# EasyEDA schematic KegMaster_Satellite_Schematic_EasyEDA_Format.json
TITLE: KegMaster_Satellite; REV: 1.1; Date: 2019-10-18; Sheet: 1/1; Drawn By: John Grenard; Company: John Grenard
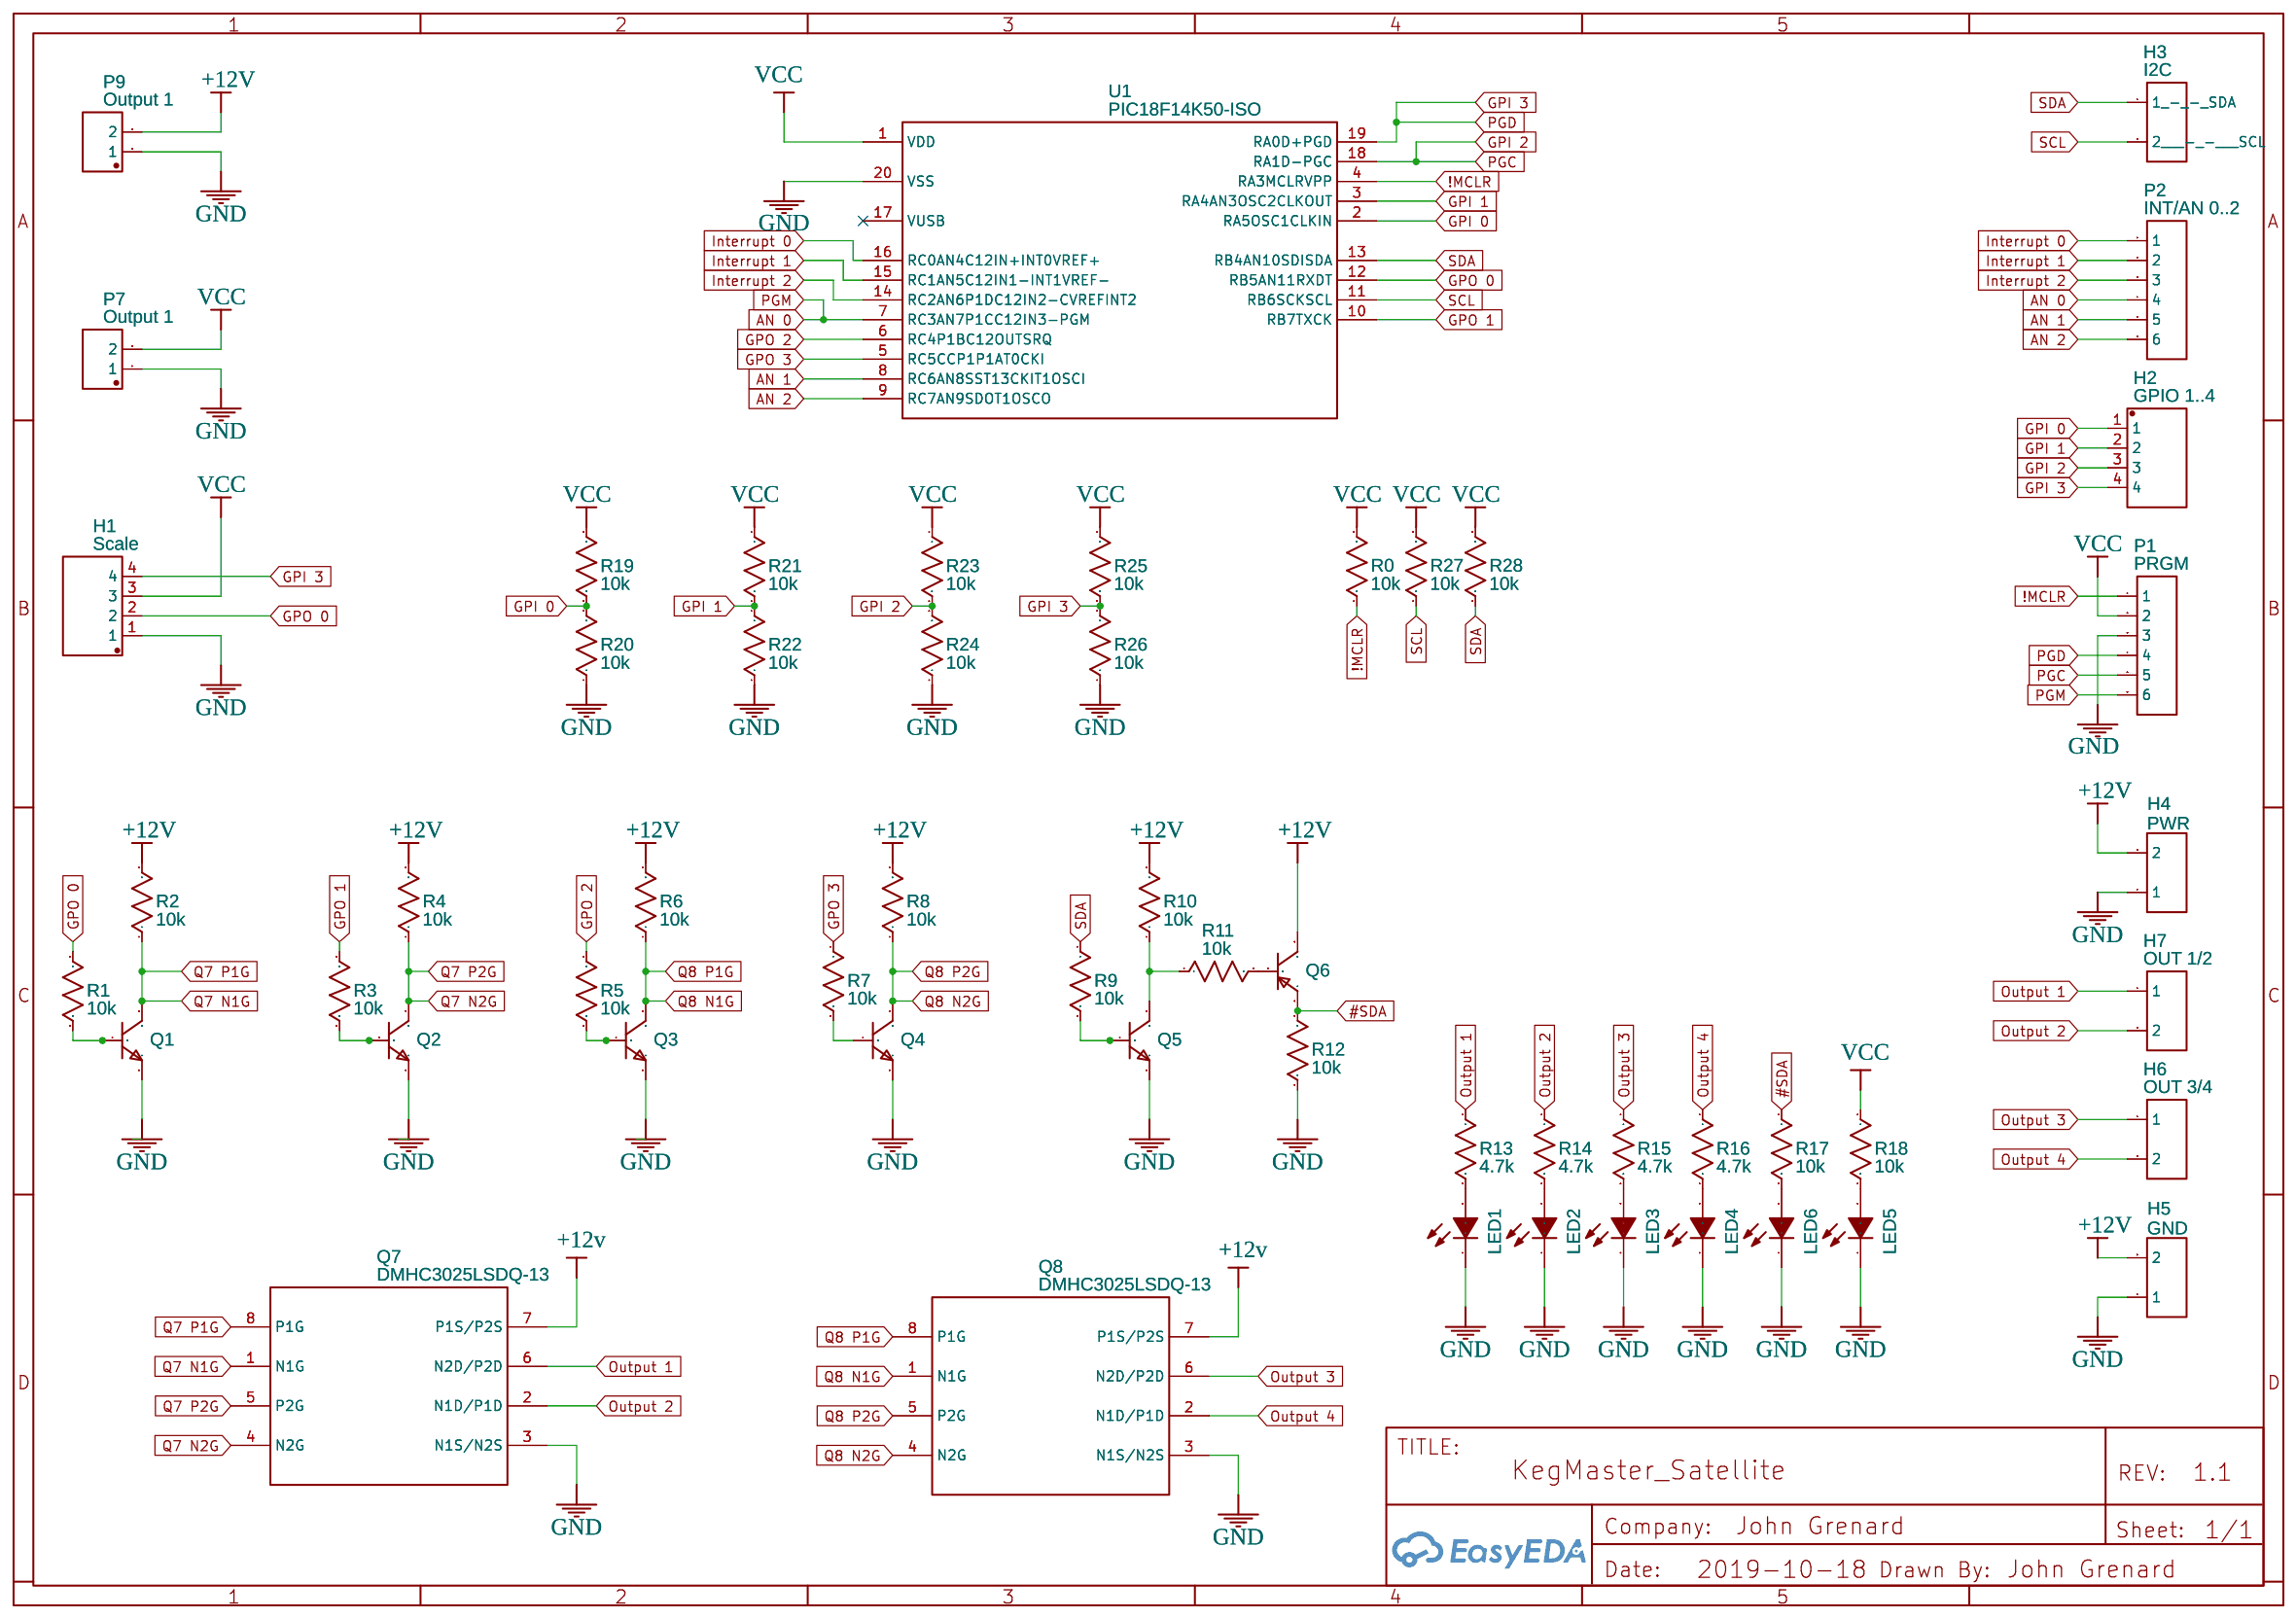
[diagram p0: schematic sheet]

## Parts
H1  Scale  [DIP-1X4P-2.54MM-M]
H2  GPIO 1..4  [DIP-1X4P-2.54MM-M]
H3  I2C  [HDR-2X1/2.54]
H4  PWR  [HDR-2X1/2.54]
H5  GND  [HDR-2X1/2.54]
H6  OUT 3/4  [HDR-2X1/2.54]
H7  OUT 1/2  [HDR-2X1/2.54]
LED1  17-21/BHC-XL2M2TY/3T  [LED0805-RD]
LED2  17-21/BHC-XL2M2TY/3T  [LED0805-RD]
LED3  17-21/BHC-XL2M2TY/3T  [LED0805-RD]
LED4  17-21/BHC-XL2M2TY/3T  [LED0805-RD]
LED5  17-21/BHC-XL2M2TY/3T  [LED0805-RD]
LED6  17-21/BHC-XL2M2TY/3T  [LED0805-RD]
P1  PRGM  [HDR-6X1/2.54]
P2  INT/AN 0..2  [HDR-6X1/2.54]
P7  Output 1  [WJ2EDGVC-5.08-2P]
P9  Output 1  [WJ2EDGVC-5.08-2P]
Q1  BC846BLT1G  [SOT-23(SOT-23-3)]
Q2  BC846BLT1G  [SOT-23(SOT-23-3)]
Q3  BC846BLT1G  [SOT-23(SOT-23-3)]
Q4  BC846BLT1G  [SOT-23(SOT-23-3)]
Q5  BC846BLT1G  [SOT-23(SOT-23-3)]
Q6  MMBT5401  [SOT-23(SOT-23-3)]
Q7  DMHC3025LSDQ-13  [SO-8_4.4MM]
Q8  DMHC3025LSDQ-13  [SO-8_4.4MM]
R0  10k  [0805]
R1  10k  [0805]
R2  10k  [0805]
R3  10k  [0805]
R4  10k  [0805]
R5  10k  [0805]
R6  10k  [0805]
R7  10k  [0805]
R8  10k  [0805]
R9  10k  [0805]
R10  10k  [0805]
R11  10k  [0805]
R12  10k  [0805]
R13  4.7k  [0805]
R14  4.7k  [0805]
R15  4.7k  [0805]
R16  4.7k  [0805]
R17  10k  [0805]
R18  10k  [0805]
R19  10k  [0805]
R20  10k  [0805]
R21  10k  [0805]
R22  10k  [0805]
R23  10k  [0805]
R24  10k  [0805]
R25  10k  [0805]
R26  10k  [0805]
R27  10k  [0805]
R28  10k  [0805]
U1  PIC18F14K50-ISO  [SOIC20]

## Library data of the parts
H1 H2 = -: Supplier: LCSC; Manufacturer: Ckmtw; Manufacturer Part: 210S-1*4P L=11.6MMGold-plated black; Contributor: LCSC; Supplier Part: C124378
H3-H7 = -: Supplier: LCSC; Manufacturer: TE Connectivity; Manufacturer Part: 826629-2; image: //image.lceda.cn/szlcsc/C86471.jpg; Supplier Part: C86471
LED1-LED6 = -: Supplier: LCSC; Manufacturer: Inolux; Manufacturer Part: 743-IN-S85AT5B; image: //image.lceda.cn/szlcsc/C72035.jpg; Supplier Part: IN-S85AT5B; LCSC Assembly: Yes; SMT Type: Extend
P1 P2 = -: Supplier: LCSC; Manufacturer: BOOMELE; Manufacturer Part: Header-Male-2.54_1x6; Supplier Part: C37208
P7 P9 = -: Supplier: LCSC; Manufacturer: ReliaPro; image: //image.lceda.cn/szlcsc/C8445.jpg; Supplier Part: C8445
Q1-Q5 = -: Supplier: Mouser; Manufacturer: CJ; Manufacturer Part: On Semi; image: //image.lceda.cn/szlcsc/C28088.jpg; LCSC Assembly: Yes; SMT Type: Extend
Q6 = -: Supplier: Mouser; Manufacturer: ON Semi; Manufacturer Part: BC846BLT1G; LCSC Assembly: Yes; image: //image.lceda.cn/szlcsc/C8326.jpg; Supplier Part: BC856BLT1G; SMT Type: Basic
Q7 Q8 = -: Supplier: LCSC; Supplier Part: C156387; Manufacturer: Diodes Incorporated; Manufacturer Part: DMHC3025LSD-13; Contributor: Munkh; LCSC Assembly: Yes; SMT Type: Extend
R0-R28 = Res_0805(1/8W)_US
U1 = -: USB Flash Microcontroller with nanoWatt XLP Technology, 20-pin SOIC, Industrial Temperature; sourceId: u7CBqoJ7W

## Nets
+12v: Q7.7(P1S/P2S) Q8.7(P1S/P2S)
+12V: H4.2 H5.2 P9.2 Q6.3(C) R2.2 R4.2 R6.2 R8.2 R10.2
GND: H1.1 H4.1 H5.1 LED1.1(-) LED2.1(-) LED3.1(-) LED4.1(-) LED5.1(-) LED6.1(-) P1.3 P7.1 P9.1 Q1.2(E) Q2.2(E) Q3.2(E) Q4.2(E) Q5.2(E) Q7.3(N1S/N2S) Q8.3(N1S/N2S) R12.1 R20.1 R22.1 R24.1 R26.1 U1.20(VSS)
VCC: H1.3 P1.2 P7.2 R0.2 R18.1 R19.1 R21.1 R23.1 R25.1 R27.2 R28.2 U1.1(VDD)
!MCLR: P1.1 R0.1 U1.4(RA3MCLRVPP)
#SDA: Q6.2(E) R12.2 R17.1
AN 0: P1.6 P2.4 U1.7(RC3AN7P1CC12IN3-PGM)
AN 1: P2.5 U1.8(RC6AN8SST13CKIT1OSCI)
AN 2: P2.6 U1.9(RC7AN9SDOT1OSCO)
GPI 0: H2.1 R19.2 R20.2 U1.2(RA5OSC1CLKIN)
GPI 1: H2.2 R21.2 R22.2 U1.3(RA4AN3OSC2CLKOUT)
GPI 2: H2.3 P1.5 R23.2 R24.2 U1.18(RA1D-PGC)
GPI 3: H1.4 H2.4 P1.4 R25.2 R26.2 U1.19(RA0D+PGD)
GPO 0: H1.2 R1.1 U1.12(RB5AN11RXDT)
GPO 1: R3.1 U1.10(RB7TXCK)
GPO 2: R5.1 U1.6(RC4P1BC12OUTSRQ)
GPO 3: R7.1 U1.5(RC5CCP1P1AT0CKI)
Interrupt 0: P2.1 U1.16(RC0AN4C12IN+INT0VREF+)
Interrupt 1: P2.2 U1.15(RC1AN5C12IN1-INT1VREF-)
Interrupt 2: P2.3 U1.14(RC2AN6P1DC12IN2-CVREFINT2)
Output 1: H7.1 Q7.6(N2D/P2D) R13.1
Output 2: H7.2 Q7.2(N1D/P1D) R14.1
Output 3: H6.1 Q8.6(N2D/P2D) R15.1
Output 4: H6.2 Q8.2(N1D/P1D) R16.1
Q7 N1G: Q1.3(C) Q7.1(N1G) Q7.8(P1G) R2.1
Q7 N2G: Q2.3(C) Q7.4(N2G) Q7.5(P2G) R4.1
Q8 N1G: Q3.3(C) Q8.1(N1G) Q8.8(P1G) R6.1
Q8 N2G: Q4.3(C) Q8.4(N2G) Q8.5(P2G) R8.1
SCL: H3.2(2   - -   SCL) R27.1 U1.11(RB6SCKSCL)
SDA: H3.1(1 - - SDA) R9.1 R28.1 U1.13(RB4AN10SDISDA)
Net-(LED1-2): LED1.2(+) R13.2
Net-(LED2-2): LED2.2(+) R14.2
Net-(LED3-2): LED3.2(+) R15.2
Net-(LED4-2): LED4.2(+) R16.2
Net-(LED5-2): LED5.2(+) R18.2
Net-(LED6-2): LED6.2(+) R17.2
Net-(Q1-1): Q1.1(B) R1.2
Net-(Q2-1): Q2.1(B) R3.2
Net-(Q3-1): Q3.1(B) R5.2
Net-(Q4-1): Q4.1(B) R7.2
Net-(Q5-1): Q5.1(B) R9.2
Net-(Q5-3): Q5.3(C) R10.1 R11.1
Net-(Q6-1): Q6.1(B) R11.2

Not connected (* = marked no-connect by the designer): U1 17(VUSB)*
